# EAGLE design CustomIO (EAGLE 7.5.0)
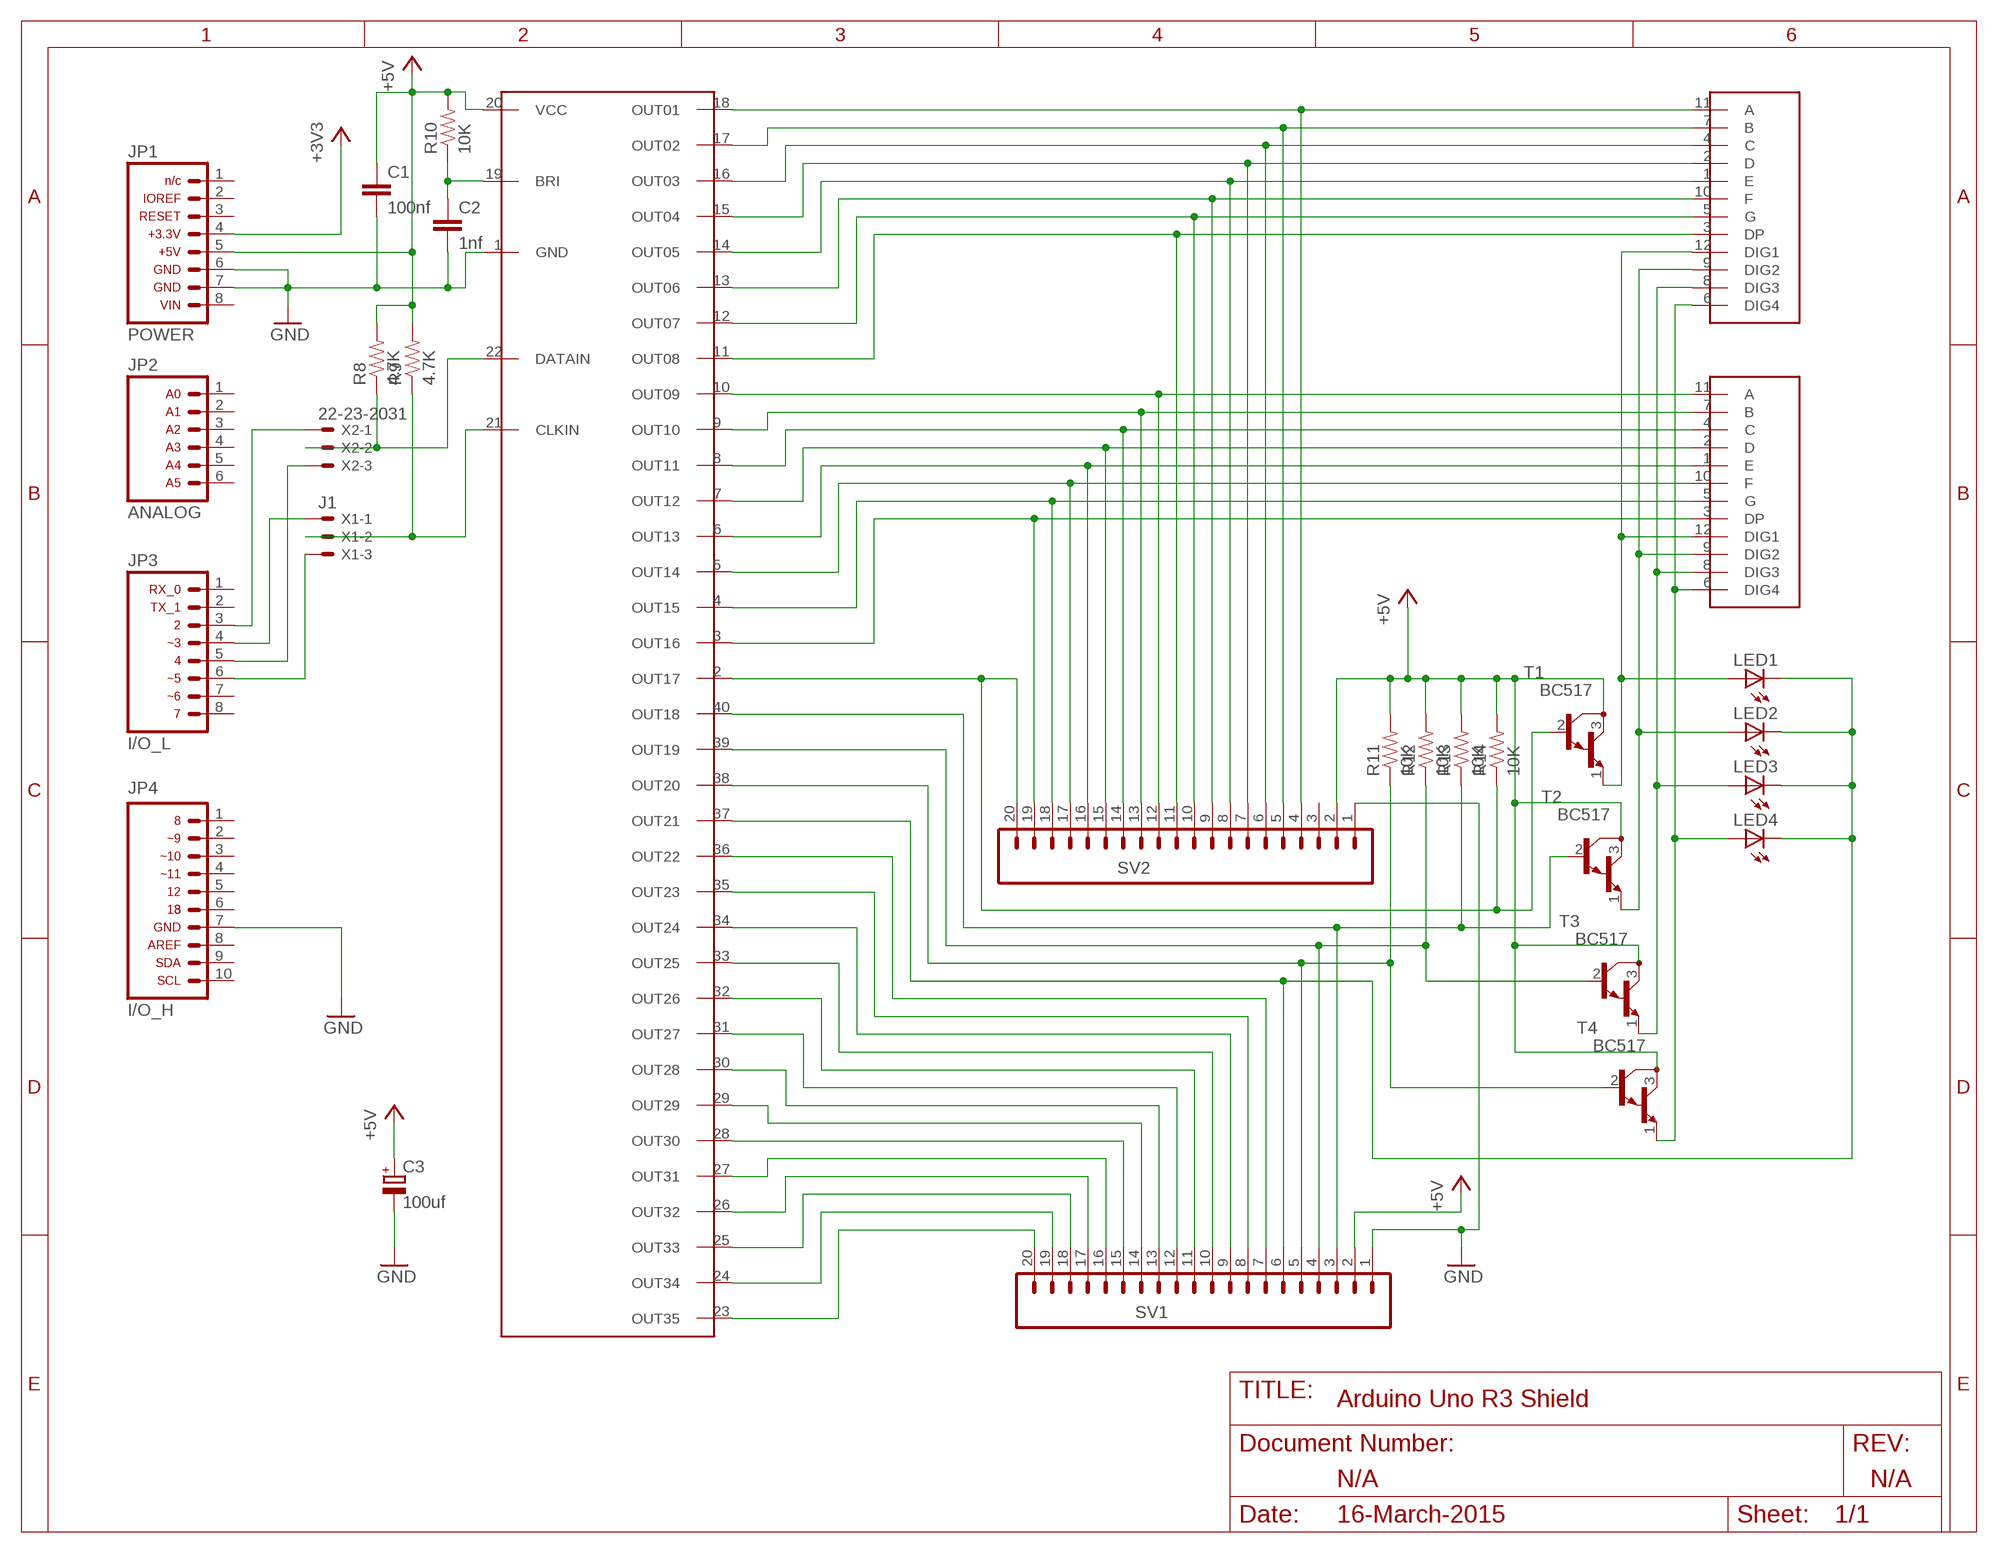
[diagram p0: schematic, sheet 1]

## Parts
C1  100nf  C2.5/4  [C2.5-4]
C2  1nf  C5/2.5  [C5B2.5]
C3  100uf  CPOL1  [E2,5-7---100UF]
JP1  ARDUINO_CONN-POWERSIP  [CONN-1X08]
JP2  ARDUINO_CONN-ANALOGSIP  [CONN-1X06]
JP3  ARDUINO_CONN-IO_LSIP  [CONN-1X08]
JP4  ARDUINO_CONN-IO_HSIP  [CONN-1X10]
LED1  LED3MM  [HLMP-D105]
LED2  LED3MM  [HLMP-D105]
LED3  LED3MM  [HLMP-D105]
LED4  LED3MM  [HLMP-D105]
R8  4.7K  10KOHM1/6W5%(PTH)KIT  [AXIAL-0.3-KIT]
R9  4.7K  10KOHM1/6W5%(PTH)KIT  [AXIAL-0.3-KIT]
R10  10K  10KOHM1/6W5%(PTH)KIT  [AXIAL-0.3-KIT]
R11  10K  10KOHM1/6W5%(PTH)KIT  [AXIAL-0.3-KIT]
R12  10K  10KOHM1/6W5%(PTH)KIT  [AXIAL-0.3-KIT]
R13  10K  10KOHM1/6W5%(PTH)KIT  [AXIAL-0.3-KIT]
R14  10K  10KOHM1/6W5%(PTH)KIT  [AXIAL-0.3-KIT]
SV1  MA10-2  [MA10-2]
SV2  MA10-2  [MA10-2]
T1  BC517  [TO92]
T2  BC517  [TO92]
T3  BC517  [TO92]
T4  BC517  [TO92]
U$1  ST-M5451PDIP40  [DIL40]
U$2  LDS-3461BXTHURHOLE  [LDS-3461BX]
U$3  LDS-3461BXTHURHOLE  [LDS-3461BX]
X1  J1  22-23-2031  [22-23-2031]
X2  22-23-2031  [22-23-2031]

## Nets
+3V3: JP1.4
+5V: C1.1 C3.+ JP1.5 R8.P$2 R9.P$2 R10.P$2 R11.P$2 R12.P$2 R13.P$2 R14.P$2 SV1.2 SV2.2 T1.3(C) T2.3(C) T3.3(C) T4.3(C) U$1.20(VCC)
GND: C1.2 C2.2 C3.- JP1.6 JP1.7 JP4.7 SV1.1 SV2.1 U$1.1(GND)
N$1: SV2.4 U$1.18(OUT01) U$2.11(A)
N$2: SV2.5 U$1.17(OUT02) U$2.7(B)
N$3: SV2.6 U$1.16(OUT03) U$2.4(C)
N$4: SV2.7 U$1.15(OUT04) U$2.2(D)
N$5: SV2.8 U$1.14(OUT05) U$2.1(E)
N$6: SV2.9 U$1.13(OUT06) U$2.10(F)
N$7: SV2.10 U$1.12(OUT07) U$2.5(G)
N$8: SV2.11 U$1.11(OUT08) U$2.3(DP)
N$9: LED4.A T4.1(E) U$2.6(DIG4) U$3.6(DIG4)
N$10: LED3.A T3.1(E) U$2.8(DIG3) U$3.8(DIG3)
N$11: LED2.A T2.1(E) U$2.9(DIG2) U$3.9(DIG2)
N$12: LED1.A T1.1(E) U$2.12(DIG1) U$3.12(DIG1)
N$13: SV2.12 U$1.10(OUT09) U$3.11(A)
N$14: SV2.13 U$1.9(OUT10) U$3.7(B)
N$15: SV2.14 U$1.8(OUT11) U$3.4(C)
N$16: SV2.15 U$1.7(OUT12) U$3.2(D)
N$17: SV2.16 U$1.6(OUT13) U$3.1(E)
N$18: SV2.17 U$1.5(OUT14) U$3.10(F)
N$19: SV2.18 U$1.4(OUT15) U$3.5(G)
N$20: SV2.19 U$1.3(OUT16) U$3.3(DP)
N$21: SV1.20 U$1.23(OUT35)
N$22: SV1.19 U$1.24(OUT34)
N$23: SV1.18 U$1.25(OUT33)
N$24: SV1.17 U$1.26(OUT32)
N$25: SV1.16 U$1.27(OUT31)
N$26: SV1.15 U$1.28(OUT30)
N$27: SV1.14 U$1.29(OUT29)
N$28: SV1.13 U$1.30(OUT28)
N$29: SV1.12 U$1.31(OUT27)
N$30: SV1.11 U$1.32(OUT26)
N$31: SV1.10 U$1.33(OUT25)
N$32: SV1.9 U$1.34(OUT24)
N$33: SV1.8 U$1.35(OUT23)
N$34: SV1.7 U$1.36(OUT22)
N$35: LED1.K(C) LED2.K(C) LED3.K(C) LED4.K(C) SV1.6 U$1.37(OUT21)
N$36: R11.P$1 SV1.5 T4.2(B) U$1.38(OUT20)
N$37: R12.P$1 SV1.4 T3.2(B) U$1.39(OUT19)
N$38: R13.P$1 SV1.3 T2.2(B) U$1.40(OUT18)
N$39: R14.P$1 SV2.20 T1.2(B) U$1.2(OUT17)
N$40: R9.P$1 U$1.21(CLKIN) X1.2
N$41: C2.1 R10.P$1 U$1.19(BRI)
N$42: R8.P$1 U$1.22(DATAIN) X2.2
N$44: JP3.3 X2.1
N$45: JP3.4 X1.1
N$46: JP3.5 X2.3
N$47: JP3.6 X1.3
Unconnected: JP1.1 JP1.2 JP1.3 JP1.8 JP2.1 JP2.2 JP2.3 JP2.4 JP2.5 JP2.6 JP3.1 JP3.2 JP3.7 JP3.8 JP4.1 JP4.2 JP4.3 JP4.4 JP4.5 JP4.6 JP4.8 JP4.9 JP4.10 SV2.3

## Library data of the parts
C1 C2 = capacitor-wima:C: CAPACITOR naming: grid - package width
C3 = ee2parts:CPOL: Electrolytic (polarised) capacitor
JP1 = _Jim:ARDUINO_CONN-POWER: Arduino Power Header
JP2 = _Jim:ARDUINO_CONN-ANALOG: Arduino Analog I/O Header
JP3 = _Jim:ARDUINO_CONN-IO_L: Arduino Digital I/O [Low Byte] Header
JP4 = _Jim:ARDUINO_CONN-IO_H: Arduino Digital I/O [High Byte] Header
LED1-LED4 = ee2parts:LED: LED round, 3mm, 2.54mm lead pitch
R8-R14 = SparkFun-Resistors:10KOHM1/6W5%(PTH): RES-08375; PROD_ID: RES-08375
SV1 SV2 = CustomIO:MA10-2: PIN HEADER; OC_FARNELL: unknown; OC_NEWARK: unknown
T1-T4 = transistor:BC517: NPN BIPOLAR DARLINGTON TRANSISTOR
U$1 = CustomIO:ST-M5451
U$2 U$3 = CustomIO:LDS-3461BX
X1 X2 = con-molex:22-23-2031: .100" (2.54mm) Center Header - 3 Pin; MF: MOLEX; MPN: 22-23-2031; OC_FARNELL: 1462950; OC_NEWARK: 30C0862

## Board
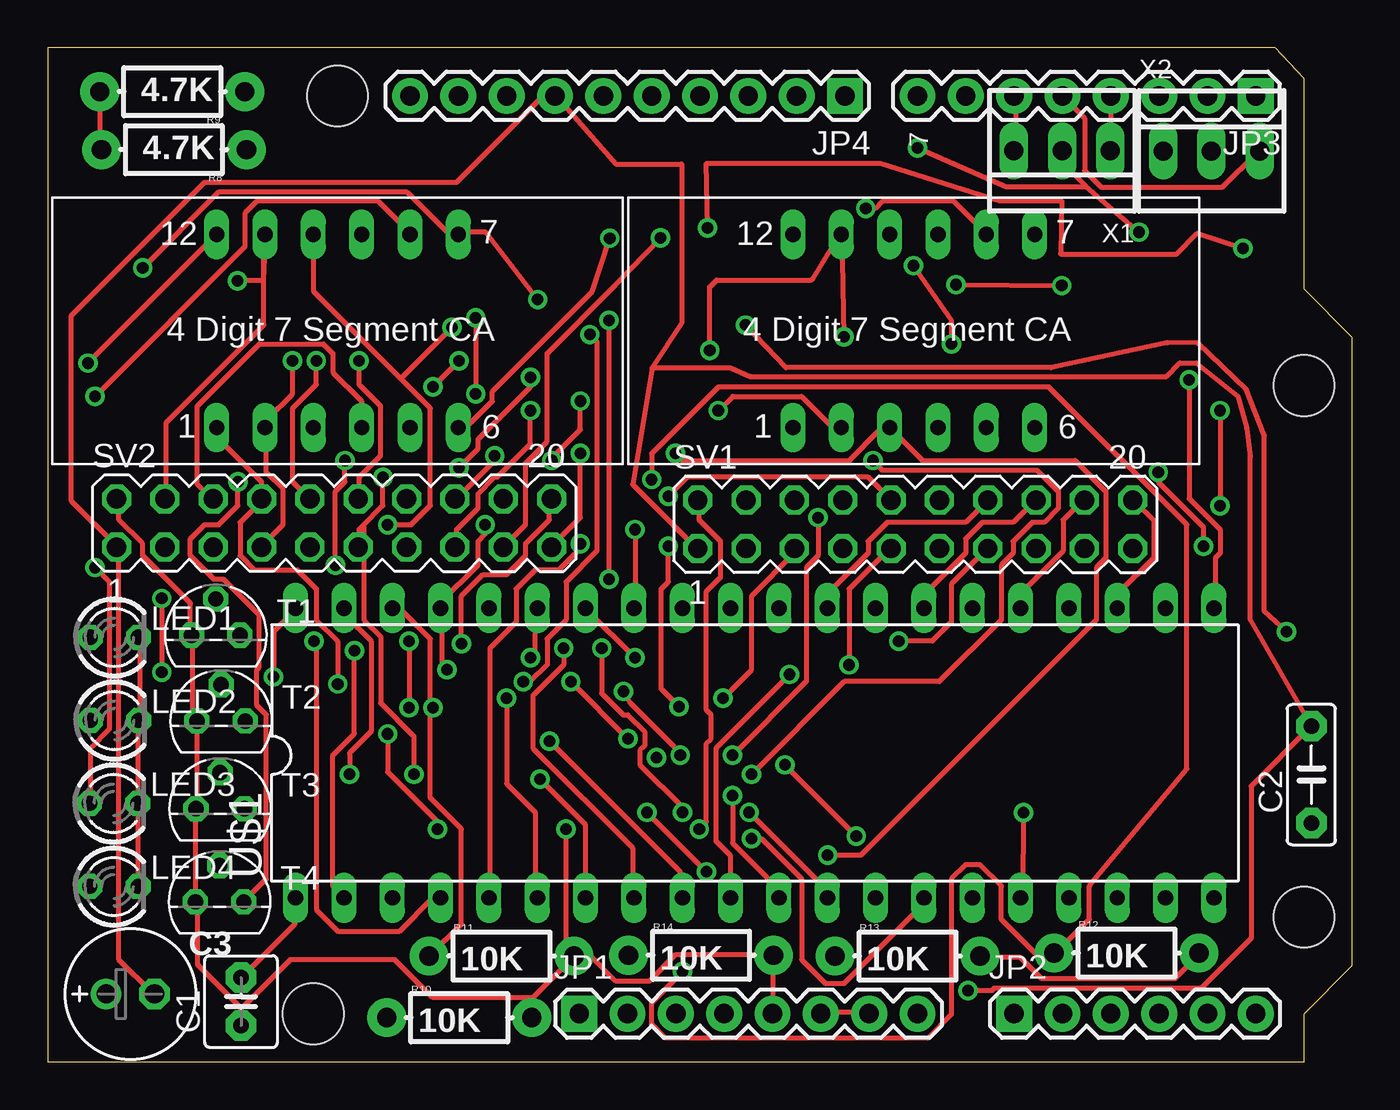
[diagram p1: board, top side]
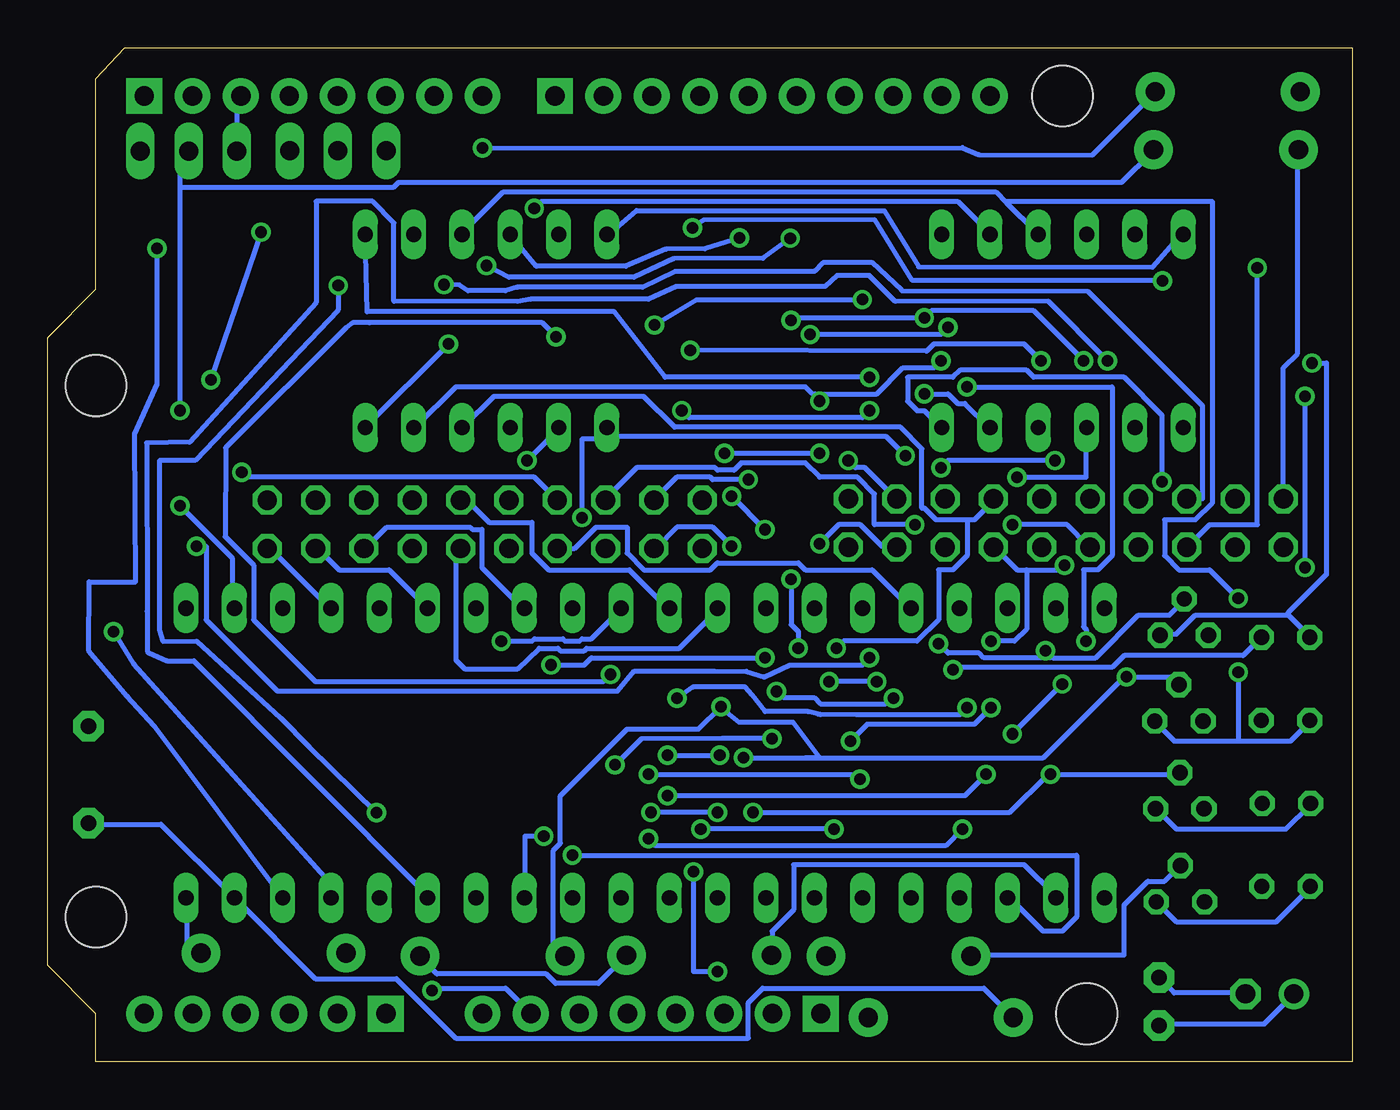
[diagram p2: board, bottom side, seen from below]

Size 68.58 x 53.34 mm. Coordinates in mm from the lower left corner, seen from the top.
Outline: 0,0 66.04,0 66.04,2.54 68.58,5.08 68.58,38.1 66.04,40.64 66.04,51.69 64.52,53.34 0,53.34 0,0
Copper layers (1*16): Top 0.035mm / dielectric 1.5mm / Bottom 0.035mm
Design rules "default": minimum track width 10mil, minimum drill 24mil, track to track 8mil, track to pad 8mil, pad to pad 8mil, via to via 8mil, smd to smd 8mil, copper to edge 40mil, drill to drill 8mil, minimum pad ring 10mil, minimum via ring 8mil, stop-mask expansion 4mil, vias tented up to drill 0mil, thermal gap 10mil
Holes 3.2 mm at 15.24,50.8 66.04,35.56 66.04,7.62 13.97,2.54

### Footprints (pad centres in the part's own frame; a part is rotated, then mirrored left to right if it is on the bottom)
C2.5-4 = drill 0.813 pad 1.6 octagon: 1 -1.27,0; 2 1.27,0
C5B2.5 = drill 0.813 pad 1.6 octagon: 1 -2.54,0; 2 2.54,0
E2,5-7---100UF = drill 1 pad 1.6: + -1.27,0 | drill 1 pad 1.6 octagon: - 1.27,0
CONN-1X08 = drill 1.016 pad 1.88 square: 1 0,0 | drill 1.016 pad 1.88: 2 2.54,0; 3 5.08,0; 4 7.62,0; 5 10.16,0; 6 12.7,0; 7 15.24,0; 8 17.78,0
CONN-1X06 = drill 1.016 pad 1.88 square: 1 0,0 | drill 1.016 pad 1.88: 2 2.54,0; 3 5.08,0; 4 7.62,0; 5 10.16,0; 6 12.7,0
CONN-1X10 = drill 1.016 pad 1.88 square: 1 0,0 | drill 1.016 pad 1.88: 2 2.54,0; 3 5.08,0; 4 7.62,0; 5 10.16,0; 6 12.7,0; 7 15.24,0; 8 17.78,0; 9 20.32,0; 10 22.86,0
HLMP-D105 = drill 0.8 octagon: A -1.27,0; K 1.27,0
AXIAL-0.3-KIT = drill 1.016 pad 2.032: P$1 -3.81,0; P$2 3.81,0
MA10-2 = drill 1.016 octagon: 1 -11.43,-1.27; 2 -11.43,1.27; 3 -8.89,-1.27; 4 -8.89,1.27; 5 -6.35,-1.27; 6 -6.35,1.27; 7 -3.81,-1.27; 8 -3.81,1.27; 9 -1.27,-1.27; 10 -1.27,1.27; 11 1.27,-1.27; 12 1.27,1.27; 13 3.81,-1.27; 14 3.81,1.27; 15 6.35,-1.27; 16 6.35,1.27; 17 8.89,-1.27; 18 8.89,1.27; 19 11.43,-1.27; 20 11.43,1.27
TO92 = drill 0.813 octagon: 1 1.27,0; 2 0,1.905; 3 -1.27,0
DIL40 = drill 0.813 long: 1 -24.13,-7.62; 2 -21.59,-7.62; 3 -19.05,-7.62; 4 -16.51,-7.62; 5 -13.97,-7.62; 6 -11.43,-7.62; 7 -8.89,-7.62; 8 -6.35,-7.62; 9 -3.81,-7.62; 10 -1.27,-7.62; 11 1.27,-7.62; 12 3.81,-7.62; 13 6.35,-7.62; 14 8.89,-7.62; 15 11.43,-7.62; 16 13.97,-7.62; 17 16.51,-7.62; 18 19.05,-7.62; 19 21.59,-7.62; 20 24.13,-7.62; 21 24.13,7.62; 22 21.59,7.62; 23 19.05,7.62; 24 16.51,7.62; 25 13.97,7.62; 26 11.43,7.62; 27 8.89,7.62; 28 6.35,7.62; 29 3.81,7.62; 30 1.27,7.62; 31 -1.27,7.62; 32 -3.81,7.62; 33 -6.35,7.62; 34 -8.89,7.62; 35 -11.43,7.62; 36 -13.97,7.62; 37 -16.51,7.62; 38 -19.05,7.62; 39 -21.59,7.62; 40 -24.13,7.62
LDS-3461BX = drill 0.8 long: 1 -6.35,-5.08; 2 -3.81,-5.08; 3 -1.27,-5.08; 4 1.27,-5.08; 5 3.81,-5.08; 6 6.35,-5.08; 7 6.35,5.08; 8 3.81,5.08; 9 1.27,5.08; 10 -1.27,5.08; 11 -3.81,5.08; 12 -6.35,5.08
22-23-2031 = drill 1 long: 1 -2.54,0; 2 0,0; 3 2.54,0

### Placement (x,y rotation side)
C1  10.17,3.18 90 top
C2  66.42,15.11 90 top
C3  4.35,3.58 0 top
JP1  27.94,2.54 0 top
JP2  50.8,2.54 0 top
JP3  63.5,50.8 180 top
JP4  41.91,50.8 180 top
LED1  3.51,22.33 0 top
LED2  3.52,17.96 0 top
LED3  3.47,13.6 0 top
LED4  3.49,9.23 0 top
R8  6.64,47.97 180 top
R9  6.55,51.02 180 top
R10  21.64,2.33 0 top
R11  23.86,5.57 0 top
R12  56.71,5.73 0 top
R13  45.2,5.57 0 top
R14  34.35,5.61 0 top
SV1  45.6,28.27 0 top
SV2  15.06,28.34 0 top
T1  8.84,22.44 0 top
T2  9.12,17.93 0 top
T3  9.07,13.31 0 top
T4  9.04,8.42 0 top
U$1  37.17,16.25 0 top
U$2  15.24,38.44 0 top
U$3  45.53,38.44 0 top
X1  53.32,47.91 180 top
X2  61.17,47.9 0 top

### Tracks (layer width: path | path; a pad name or v marks a point on that pad's centre or on a via)
+5V  (via drill 0.61)
  Top 0.254: R8.P$2 2.75,48 2.75,51 R9.P$2 | SV2.2 3.75,29.5 3.75,28.5 5,27.25 5,26.62 7.5,24.12 7.5,22.5 T1.3 7.62,22.38 7.62,18.12 7.75,18 T2.3 7.88,17.88 7.88,13.38 T3.3 7.75,13.25 7.75,8.5 T4.3 7.88,8.38 7.88,5.12 10.12,2.88 | 10.12,2.88 10.12,2 C1.1 | v34.25,12.25 34.62,12.62 34.62,16.75 34.88,17 34.88,18.25 34.62,18.5 34.62,24.75 35.38,25.5 35.38,27.38 34.25,28.5 34.25,29.5 SV1.2 | v27.25,12.25 27.25,6 27.62,5.62 R11.P$2 | 25.5,3.38 25.5,2.38 R10.P$2 | 25.5,3.38 27.62,5.5 R11.P$2 | JP1.5 38.12,2.62 38.12,5.5 R14.P$2 38.12,5.62 33,5.62 31.62,4.25 29.88,4.25 28.62,5.5 27.75,5.5 R11.P$2 | 61.38,8.75 U$1.20 | R13.P$2 49.12,5.5 51.12,5.5 52.25,4.38 59.25,4.38 60.5,5.62 R12.P$2 | 25.5,3.38 20.25,3.38 18.25,5.38 12.75,5.38 10.25,2.88 10.12,2.88
  Bottom 0.254: C3.+ 3.12,3.5 4.62,2 10.12,2 C1.1 | R8.P$2 2.88,47.88 2.88,37.25 3.62,36.5 3.62,29.62 SV2.2 | v27.25,12.25 v34.25,12.25 | R13.P$2 49,5.5 48.12,4.62 42.38,4.62 41.88,4.12 39.62,4.12 38.25,5.5 R14.P$2 | U$1.20 61.25,8.62 61.25,5.75 60.62,5.75 R12.P$2
GND  (via drill 0.61)
  Top 0.254: JP1.6 40.75,2.62 43.12,2.62 JP1.7 | v48.38,3.75 49.62,3.75 49.75,3.88 60.62,3.88 63.25,6.5 63.25,14.5 66.38,17.62 C2.2 66.38,17.75 63.21,23.23 63.2,31.81 63.02,33.33 62.55,35.01 60.38,36.75 59.51,36.75 58.82,36.04 36.94,36.04 35.88,36.5 31.78,36.5 | 31.78,36.5 33.32,38.84 33.32,47.22 29.87,47.22 26.75,50.75 JP4.7 26.62,50.75 26,50.75 21.5,46.25 8.25,46.25 1.25,39.25 1.25,29.5 3.62,27.12 SV2.1 3.75,27 3.75,5.38 5.5,3.62 C3.- | 31.78,36.5 30.75,30.38 34.12,27 SV1.1 | U$1.1 13,8.62 13,7.25 10.25,4.5 C1.2
  Bottom 0.254: v48.38,3.75 48.25,3.88 44.5,3.88 43.25,2.62 JP1.7 | C1.2 10.12,4.38 9.38,3.62 5.62,3.62 C3.-
N$1  (via drill 0.61)
  Top 0.254: SV2.4 6.25,29.62 6.25,33.62 11.38,38.75 11.38,43.5 U$2.11 11.34,41.08 v9.99,41.08 | v34.69,43.86 34.62,47.25 43.77,47.25 50.02,45.28 53.29,45.28 53.24,42.48 59.35,42.49 60.43,43.57 60.48,43.56 v62.82,42.78
  Bottom 0.254: U$1.18 62.96,17.66 64.38,19.23 66.41,21.61 66.4,25.24 63.95,25.24 64,33.01 62.82,35.65 v62.82,42.78 | v9.99,41.08 23.13,41.09 25.11,44.29 34.12,44.26 v34.69,43.86
N$2  (via drill 0.61)
  Top 0.254: v5,41.75 9,45.75 18.88,45.75 21,43.62 21.5,43.62 U$2.7 21.62,43.62 21.64,43.63 23.03,43.63 v25.76,40.09 | v65.11,22.63 63.95,23.68 63.95,32.94 63,35.36 60.45,37.81 58.87,37.82 52.75,36.51 38.81,36.51 v36.69,38.75
  Bottom 0.254: v5,41.75 5,28.25 7.5,28.25 8.62,27.12 SV2.5 | U$1.17 53.83,8.78 53.76,9.45 64.04,20.93 v65.11,22.63 | v36.69,38.75 34.47,40.08 v25.76,40.09
N$3  (via drill 0.61)
  Top 0.254: U$2.4 16.5,33.38 16.5,34.75 15,36.25 15,37.25 14.5,37.75 11.12,37.75 7.88,34.5 7.88,30.38 8.62,29.62 SV2.6 | v51.29,13.11 51.25,8.75 U$1.16 | v47.75,40.88 v53.3,40.83
  Bottom 0.254: v51.29,13.11 54.84,16.61 56.32,18.08 60.75,22.12 62.52,22.12 62.71,22.73 62.7,31.62 60.83,31.63 53.31,39.53 v53.3,40.83 | v47.75,40.88 46.93,40.85 46.49,40.55 44.51,40.55 43.89,40.73 37.31,40.73 35.61,41.56 28.26,41.57 28.26,41.59 27.83,42.02 25.23,42.02 23.68,40.58 23.68,40.54 13.88,40.5 7.88,34.5 7.88,29.62 8.62,29.62 SV2.6
N$4  (via drill 0.61)
  Top 0.254: SV2.7 11.25,27.12 12.38,28.25 12.38,30.12 11.5,31 11.5,33.25 U$2.2 11.5,33.38 11.5,33.75 12.88,35.12 v12.88,36.88
  Bottom 0.254: v12.88,36.88 16,40 24.02,39.99 25.39,41.36 27.08,41.36 27.72,40.78 35.55,40.78 36.99,40.11 43.19,40.1 43.88,39.99 50.38,40 50.38,44.12 51.5,45.25 54.47,45.25 54.47,39.93 61.11,32.59 63.38,32.55 63.34,23.7 63.34,21.59 63.29,21.53 62.29,21.09 60.9,21.09 48.62,8.75 U$1.15
N$5  (via drill 0.61)
  Top 0.254: U$2.1 9,33.25 9,32.75 11.25,30.5 SV2.8 11.25,29.5 10.12,28.38 10.12,26.62 10.88,25.88 13.12,25.88 14.12,24.88 14.12,23.25 15.25,22.12 v15.25,19.88 | v37,11.75 37.5,11.75 39.62,9.62 39.62,5.38 40.88,4.12 41.88,4.12 46,8.25 46,8.62 U$1.14 | v20.5,12.25 20.5,12.62 17.88,15.25 v17.88,17.25
  Bottom 0.254: v37,11.75 36.62,11.38 21.38,11.38 v20.5,12.25 | v15.25,19.88 v17.88,17.25
N$6  (via drill 0.61)
  Top 0.254: 18.56,35.94 20.12,34.38 20.12,29.25 19.12,28.25 v17.88,28.25 | 18.56,35.94 14,40.5 14,43.5 U$2.10 | v38.75,15.62 v42.5,11.88 | v27.5,20 v30.5,17 | v25,20 25.38,20 26.25,20.88 26.25,22.25 27.25,23.25 27.25,25.25 28.88,26.88 28.88,37.88 v28.5,38.25 | 18.56,35.94 v21.25,38.62
  Bottom 0.254: v17.88,28.25 15,28.25 13.88,27.12 SV2.9 | v42.5,11.88 43.5,11.88 43.5,8.75 U$1.13 | v38.75,15.62 37.38,17 33.1,17.02 30.52,17.02 v30.5,17 | v25,20 v27.5,20 | v28.5,38.25 21.62,38.25 v21.25,38.62
N$7  (via drill 0.61)
  Top 0.254: v22.5,39.12 v22.5,35.12 | v14.12,36.88 14.12,35.62 12.88,34.38 12.88,30.5 13.75,29.62 SV2.10 | v36.88,13.12 40.88,9.12 40.88,8.75 U$1.12 | v33.38,13.12 33.38,13.38 31.12,15.62 31.12,16.38 31.38,16.62 31.38,17.38 30.5,18.25 30.25,18.25 29.12,19.38 v29.12,21.75 | v29.5,39 v29.5,25.38
  Bottom 0.254: v22.5,35.12 21.25,35.12 20.75,34.62 20.38,34.62 19.12,33.38 U$2.5 | v14.12,36.88 16.75,39.5 22.12,39.5 v22.5,39.12 29.38,39.12 v29.5,39 | v33.38,13.12 v36.88,13.12 | v29.12,21.75 29.12,22.62 29.5,23 v29.5,25.38
N$8  (via drill 0.61)
  Top 0.254: v17.62,30.75 17.62,29.25 16.56,28.19 | 16.56,28.19 16.38,28 16.38,27.12 SV2.11 | v36,14 36,11.5 38.38,9.12 38.38,8.75 U$1.11 | v19.25,15.12 19.25,17.12 17.5,18.88 17.5,22.38 16.62,23.25 16.62,28.12 16.56,28.19
  Bottom 0.254: v17.62,30.75 14,30.75 14,33.25 U$2.3 | v36,14 20.38,14 v19.25,15.12
N$9  (via drill 0.61)
  Top 0.254: v10,30.5 10,29.25 9,28.25 8.25,28.25 7.5,27.5 7.5,26.62 8.75,25.38 9.25,25.38 11.12,23.5 11.12,20.75 11,20.62 11,18.75 11.5,18.25 11.5,9.62 10.38,8.5 T4.1 | v47.5,37.75 47.5,39 v45.51,41.88 | v29.55,43.31 28.62,40.5 23.38,35.25 23.38,34.75 22,33.38 21.62,33.38 U$2.6
  Bottom 0.254: LED4.A 2.25,9.12 4,7.38 9.25,7.38 10.25,8.38 T4.1 | v10,30.5 10,34 12,36 16.75,36 17.12,36.38 20.62,36.38 21,36 23.38,36 23.38,34.75 22.88,34.25 22.5,34.25 21.62,33.38 U$2.6 | v47.5,37.75 51.88,33.38 U$3.6 | v45.51,41.88 44.34,41.26 37.75,41.26 35.68,42.23 30.99,42.26 v29.55,43.31
N$10  (via drill 0.61)
  Top 0.254: v43,44.88 43.5,44.88 43.88,45.25 47.62,45.25 49.25,43.62 U$3.8 | v2.5,26 3.25,25.25 3.25,17.5 2.25,16.5 2.25,13.62 LED3.A | v2.5,35 10.38,42.88 10.38,44.62 11,45.25 17.38,45.25 19,43.62 U$2.8
  Bottom 0.254: LED3.A 2.25,13.5 3.5,12.25 9.25,12.25 10.25,13.25 T3.1 | v43,44.88 42.62,45.25 20.75,45.25 19.12,43.62 U$2.8 | v2.5,35 v2.5,26
N$11  (via drill 0.61)
  Top 0.254: v6,24.38 v6,20.5
  Bottom 0.254: 6,16.88 9.38,16.88 10.38,17.88 T2.1 | 6,16.88 3.25,16.88 2.25,17.88 LED2.A | 18.19,45.19 18.75,45.75 44.62,45.75 46.75,43.62 U$3.9 | 18.19,45.19 16.62,43.62 U$2.9 | v6,20.5 6,16.88 | v6,24.38 7.5,25.88 9.12,25.88 9.88,26.62 9.88,28.5 8.25,28.5 7.38,29.38 7.38,45.25 18.12,45.25 18.19,45.19
N$12  (via drill 0.61)
  Top 0.254: v2.12,36.75 8.88,43.5 U$2.12
  Bottom 0.254: 3.38,23.5 2.25,22.38 LED1.A | 3.38,23.5 8.25,23.5 9.25,22.5 10,22.5 T1.1 | U$2.12 9,43.5 10.49,41.78 22.8,41.81 24.6,44.76 37.63,44.77 39.12,43.5 U$3.12 | v2.12,36.75 1.38,36.75 1.38,25.62 3.38,23.62 3.38,23.5
N$13  (via drill 0.61)
  Top 0.254: v34.8,37.42 34.8,40.75 35.17,41.12 40.13,41.12 40.23,41.22 41.62,43.5 U$3.11 41.75,43.5 v41.85,38.13 | v16.38,36.88 16.38,35.62 17.5,34.5 17.5,31.88 16.38,30.75 16.38,29.62 SV2.12 | v39,20.38 35.12,16.5 35.12,11.62 35.88,10.88 35.88,8.75 U$1.10
  Bottom 0.254: v34.8,37.42 22.38,37.38 22,37.75 17.25,37.75 v16.38,36.88 | v39,20.38 39.38,20 54.5,20 57.75,23.25 57.75,26.12 59.25,27.62 59.22,32.3 52.88,38.62 52.55,38.87 51.65,38.87 42.59,38.87 v41.85,38.13
N$14  (via drill 0.61)
  Top 0.254: v25.38,36 25.38,35.5 22.62,32.75 22.62,32.25 v21.62,31.25 | v15.62,31.62 15.62,30.5 15.12,30 v15.12,26.12 | v26.38,16.88 33.25,10 33.25,8.75 U$1.9 | v19,22.12 v19,18.62
  Bottom 0.254: v25.38,36 36.12,36 38.78,39.45 51.78,39.45 51.88,43.5 U$3.7 | v21.62,31.25 21.25,31.62 v15.62,31.62 | v15.12,26.12 15.38,25.88 17.12,25.88 | 17.12,25.88 17.62,25.88 18.75,27 SV2.13 | v26.38,16.88 25.5,17.75 19.88,17.75 v19,18.62 | v19,22.12 17.75,22.12 17.12,22.75 17.12,25.88
N$15  (via drill 0.61)
  Top 0.254: v27.12,21.75 27.12,20.88 25.5,19.25 25.5,16.5 30.75,11.25 30.75,8.75 U$1.8
  Bottom 0.254: 20.25,28.5 19.88,28.5 18.88,29.5 SV2.14 | 20.25,28.5 21.88,28.5 22.5,29.12 22.62,29.12 22.62,32.25 23.75,33.38 35.62,33.38 37.25,35 45.12,35 46.75,33.38 U$3.4 | v27.12,21.75 26.75,22.12 22.88,22.12 21.75,23.25 21.75,25.88 21,25.88 20.25,26.62 20.25,28.5
N$16  (via drill 0.61)
  Top 0.254: v35.25,34.25 36,35 39.62,35 41.25,33.38 41.62,33.38 U$3.2 | v25.38,34.25 25.38,32.5 23.62,30.75 23.5,30.75 22.62,29.88 22.62,29.12 21.5,28 21.5,27.12 SV2.15 | v25.88,14.88 28.25,12.5 28.25,8.75 U$1.7 | v37,15.12 41.88,20 46.88,20 50.12,23.25 50.12,26.12 50.75,26.75 50.75,27.38 51.75,28.38 52.38,28.38 53.12,29.12 53.12,30 52,31.12 43.88,31.12 v43.38,31.62
  Bottom 0.254: v35.25,34.25 34.88,33.88 25.75,33.88 v25.38,34.25 | v25.88,14.88 26.12,15.12 v37,15.12 | v43.38,31.62 41.75,33.25 U$3.2
N$17  (via drill 0.61)
  Top 0.254: v23.5,31.88 23.5,31.62 21.5,29.62 SV2.16 | v24.12,19.12 24.12,14.62 25.62,13.12 25.62,8.75 U$1.6 | v30.27,19.48 30.62,18.88 33.25,16.25 v33.25,16.12 | v36,16.12 39.88,20 39.88,26 40.5,26.62 v40.5,28.62
  Bottom 0.254: v23.5,31.88 24.5,32.88 38.75,32.88 39.12,33.25 U$3.1 38.75,32.75 40.5,32.75 v40.5,28.62 | v30.27,19.48 29.92,19.18 28.64,19.16 28.29,19.16 27.96,18.83 24.53,18.83 24.18,19.18 v24.12,19.12 | v36,16.12 v33.25,16.12
N$18  (via drill 0.61)
  Top 0.254: v32.22,43.33 29.88,40.88 26.25,37.25 26.25,32.62 25.12,31.5 25.12,28.25 24,27.12 SV2.17 | v28,27.25 28,27 26.88,25.88 25.62,25.88 24.62,24.88 24.62,23.12 23.25,21.75 23.25,8.75 U$1.5
  Bottom 0.254: v32.22,43.33 34.02,42.76 36.08,42.74 38.19,41.84 42.9,41.84 44.25,43.5 U$3.10 | v28,27.25 27,28.25 25.88,28.25 24.75,27.12 24,27.12 SV2.17
N$19  (via drill 0.61)
  Top 0.254: v28,34.75 28,33.25 26.5,31.75 v26.5,31.62 | v14,22.12 14.12,22 14.12,8 15.25,6.88 18.5,6.88 20.25,8.62 20.62,8.62 U$1.4 | v21.62,36.88 v20.25,35.5
  Bottom 0.254: v26.5,31.62 26.12,31.25 25.62,31.25 24,29.62 SV2.18 | U$3.5 49.25,33.38 47.12,35.5 28.75,35.5 v28,34.75 28.25,35.12 25,35.12 23.62,36.5 22,36.5 v21.62,36.88 | v14,22.12 14,22.75 14.12,22.88 14.12,25.88 13.38,25.88 12.62,26.62 12.62,35.5 v20.25,35.5
N$20  (via drill 0.61)
  Top 0.254: v33,32 33.38,31.62 42.12,31.62 43.75,33.25 44.25,33.25 U$3.3 44.38,33.25 46,31.62 54,31.62 55.62,30 55.62,26.5 55.12,26 55.12,23.25 42.75,10.88 v41,10.88 | v28,32 28,28.62 26.5,27.12 SV2.19
  Bottom 0.254: v28,32 v33,32 | v41,10.88 14.5,10.88 14.5,7.62 15.25,6.88 16.25,6.88 18,8.62 U$1.3
N$21
  Top 0.254: U$1.23 56.25,23.88 56.25,24.62 58.12,26.5 58.12,28.5 57.12,29.5 SV1.20
N$22
  Bottom 0.254: SV1.19 56.88,27 53.75,23.88 U$1.24
N$23
  Top 0.254: U$1.25 51.25,23.88 51.25,24.75 53.38,26.88 53.38,28.5 54.38,29.5 SV1.18
N$24
  Bottom 0.254: U$1.26 48.62,23.88 50.62,25.88 53.25,25.88 54.38,27 SV1.17
N$25
  Top 0.254: U$1.27 46.12,23.88 46.12,24.62 48.25,26.75 48.25,27.5 49.12,28.38 50.75,28.38 51.88,29.5 SV1.16
N$26
  Bottom 0.254: U$1.28 43.62,23.88 45.75,26 45.75,28 46.25,28 46.38,28.12 50.75,28.12 51.88,27 SV1.15
N$27
  Top 0.254: U$1.29 41,23.88 41,24.62 43.12,26.75 43.12,27.38 44.12,28.38 48.25,28.38 49.38,29.5 SV1.14
N$28  (via drill 0.61)
  Top 0.254: v44.73,22.12 46.5,22.12 47.5,23.12 47.5,25.12 49.38,27 SV1.13
  Bottom 0.254: v44.73,22.12 43.12,22.12 43,22.25 41.5,22.25 41.38,22.12 40.62,22.12 40.5,22.25 40,22.25 38.5,23.75 U$1.30
N$29
  Bottom 0.254: U$1.31 36,23.88 38,25.88 42.25,25.88 43.12,26.75 43.12,28.38 45.38,28.38 46.5,29.5 46.75,29.5 SV1.12
N$30
  Bottom 0.254: SV1.11 47.12,27 47.12,21.14 46.66,20.67 43.87,20.67 42.75,21.75 41.75,21.75 41.62,21.62 40.38,21.62 40.25,21.75 35.38,21.75 33.38,23.75 U$1.32
N$31  (via drill 0.61)
  Top 0.254: v30.88,28 30.88,23.88 U$1.33 | v32.62,29.75 33.62,30.75 43.12,30.75 44.25,29.62 SV1.10
  Bottom 0.254: v32.62,29.75 v30.88,28
N$32  (via drill 0.61)
  Top 0.254: v30.88,21.25 28.38,23.75 U$1.34 | v42.12,20.88 42.12,24.88 44.25,27 SV1.9
  Bottom 0.254: v30.88,21.25 40,21.25 40.38,20.88 v42.12,20.88
N$33  (via drill 0.61)
  Top 0.254: v25.38,21.25 25.62,21.5 25.62,23.75 U$1.35 | v60.75,27.12 60.75,28.12 58.38,30.5 v58.38,31
  Bottom 0.254: v25.38,21.25 25.75,20.88 29.57,20.87 30.91,20.25 30.91,20.24 31.85,20.54 33.53,20.55 37.73,20.55 38.62,19.5 56.5,19.5 60.25,23.25 60.25,27.12 v60.75,27.12 | v58.38,31 58.12,30.75 43,30.75 SV1.8
N$34
  Bottom 0.254: SV1.7 40.88,27 39.75,28.12 38.12,28.12 38.12,26.75 37.25,25.88 33.75,25.88 33.38,26.25 29.12,26.25 28.75,25.88 25.25,25.88 23.25,23.88 U$1.36
N$35  (via drill 0.61)
  Top 0.254: LED4.K 4.75,9.25 4.75,13.5 LED3.K 4.75,13.62 4.75,17.88 LED2.K 4.88,18 4.88,22.25 LED1.K | v21,20.62 20.75,20.88 20.75,23.75 U$1.37 20.62,24 20.62,24.12 22.62,26.12 22.62,27.38 23,27.75 v23,28.25
  Bottom 0.254: v21,20.62 20.88,20.75 12.62,20.75 12,21.38 5.75,21.38 4.88,22.25 LED1.K | v23,28.25 25.12,28.25 25.12,29.88 26,30.75 28,30.75 28.75,31.5 32.12,31.5 32.5,31.12 33.38,31.12 33.5,31.25 37.62,31.25 39.25,29.62 SV1.6
N$36  (via drill 0.61)
  Top 0.254: 20.12,18.62 20.12,13.88 21.75,12.25 21.75,7.25 20.12,5.62 R11.P$1 | 20.12,18.62 20.12,22.25 18.62,23.75 18.12,23.75 U$1.38 | SV1.5 39.25,26.75 37,24.5 37,20.62 v35.5,19.12 | v20.25,18.62 20.12,18.62
  Bottom 0.254: T4.2 9.12,10.25 9.88,9.5 10.75,9.5 12,8.25 12,5.62 20,5.62 R11.P$1 | v35.5,19.12 34.66,19.72 31.91,19.72 31.55,19.3 30.87,18.43 28.62,18.43 28.1,18.3 27.96,18.27 26.06,18.26 25.68,18.26 20.62,18.25 v20.25,18.62
N$37  (via drill 0.61)
  Top 0.254: v15.88,15.12 15.88,16.25 17,17.38 17,22.12 15.62,23.5 15.62,23.75 U$1.39 | v31.75,30.62 31.75,32 35.25,35.5 52.62,35.5 59.88,28.25 59.88,15.38 54.75,9.25 54.75,7.5 53,5.75 R12.P$1 52.88,5.75 51.88,5.75 50.12,7.5 50.12,9.25 49,10.38 48.25,10.38 47.5,9.62 47.5,2.5 46.25,1.25 32.5,1.25 31.75,2 31.75,3.12 v33.38,4.75 | v34.62,10 v31.5,13.12
  Bottom 0.254: T3.2 9.12,15.12 v15.88,15.12 16,15.12 18,13.12 v31.5,13.12 | SV1.4 35.5,30.75 33.75,30.75 33.62,30.62 v31.75,30.62 | v34.62,10 34.62,4.75 v33.38,4.75
N$38  (via drill 0.61)
  Top 0.254: v11.88,20.25 11.88,22.62 13,23.75 U$1.40 | v32.62,27.12 32.62,25.25 32.25,24.88 32.25,19.62 v33.19,18.68
  Bottom 0.254: T2.2 9.12,19.88 9.5,20.25 v11.88,20.25 12,20.25 16.25,16 28.75,16 | v32.62,27.12 33.62,28.12 35.5,28.12 36.62,27 SV1.3 | R13.P$1 41.5,5.62 42,5.62 42,11.12 41.62,11.5 41.62,14 38.12,17.5 34.38,17.5 v33.19,18.68 33.12,18.62 33.15,18.59 | v32,16 28.75,16 | 33.23,18.66 33.15,18.59 | 33.15,18.59 32.25,17.88 29.41,17.87 28,15.99 28.75,16
N$39  (via drill 0.61)
  Top 0.254: v16.12,21.62 16.12,17.25 15,16.12 15,9.25 15.5,8.75 U$1.2 | v21.75,22 21.75,24.5 22.88,25.62 24.12,25.62 25.12,26.62 25.12,27.25 26.38,28.5 26.38,29.5 SV2.20
  Bottom 0.254: T1.2 8.88,24.25 9.62,23.5 11.25,23.5 13.5,21.25 15.75,21.25 v16.12,21.62 15.88,21.25 19.38,21.25 19.62,21.5 21.25,21.5 v21.75,22 | R14.P$1 30.5,5.62 30.5,6.88 29.38,8 29.38,10.38 17.25,10.38 15.62,8.75 U$1.2
N$40  (via drill 0.61)
  Top 0.254: v60,35.88 60,29.62 61.62,28 61.62,26.75 61.38,26.5 61.38,23.88 U$1.21 | 54.56,46.06 53.38,47.25 53.38,47.88 X1.2 | 54.56,46.06 v57.36,43.63 | v45.72,48.06 50.38,46 54.5,46 54.56,46.06
  Bottom 0.254: v57.36,43.63 v60,35.88 | v45.72,48.06 20.49,48.08 20.51,48.07 19.64,47.71 19.59,47.7 13.68,47.69 10.38,51 R9.P$1
N$41
  Bottom 0.254: C2.1 66.38,12.5 62.62,12.5 58.88,8.75 U$1.19 54.5,4.38 50.25,4.38 47.12,1.25 31.75,1.25 31.75,3.12 31,3.88 19.38,3.88 R10.P$1
N$42  (via drill 0.61)
  Top 0.254: v61.62,34.25 v61.62,29.25
  Bottom 0.254: v61.62,29.25 58.88,26.5 58.88,23.88 U$1.22 | 61.62,46 61.62,47.88 61.25,47.88 X2.2 | 61.62,46 v61.62,34.25 | 61.62,46 50.38,46 50.12,46.25 12.12,46.25 10.5,47.88 R8.P$1
N$44
  Bottom 0.254: X2.1 58.62,48 58.62,50.75 58.5,50.75 JP3.3
N$45
  Top 0.254: X1.1 55.88,48 55.88,50.75 JP3.4
N$46
  Top 0.254: X2.3 63.62,47.88 61.75,46 55.38,46 54.5,46.88 54.5,49.62 53.38,50.75 JP3.5
N$47
  Top 0.254: X1.3 50.88,48 50.88,50.75 JP3.6

### Text on the board
tPlace: 7